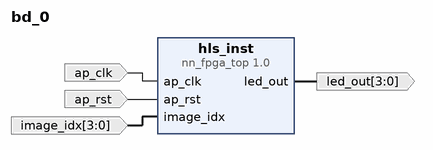
[diagram p0: block diagram of the top level]
# Vivado block design bd_0, xc7a35tcpg236-1, Vivado 2025.1
create_bd_design bd_0

create_bd_port -dir I -type clk ap_clk
set_property -dict {CONFIG.FREQ_HZ 100000000.0} [get_bd_ports ap_clk]
create_bd_port -dir I -type rst ap_rst
set_property -dict {CONFIG.POLARITY ACTIVE_HIGH} [get_bd_ports ap_rst]
create_bd_port -dir I -from 3 -to 0 -type data image_idx
create_bd_port -dir O -from 3 -to 0 -type data led_out

create_bd_cell -type ip -vlnv xilinx.com:hls:nn_fpga_top:1.0 hls_inst

# ---- connections ----

connect_bd_net -net ap_clk_0_1 [get_bd_ports ap_clk] [get_bd_pins hls_inst/ap_clk]
connect_bd_net -net ap_rst_0_1 [get_bd_ports ap_rst] [get_bd_pins hls_inst/ap_rst]
connect_bd_net [get_bd_pins hls_inst/led_out] [get_bd_ports led_out]
connect_bd_net -net image_idx_0_1 [get_bd_ports image_idx] [get_bd_pins hls_inst/image_idx]

validate_bd_design
save_bd_design
